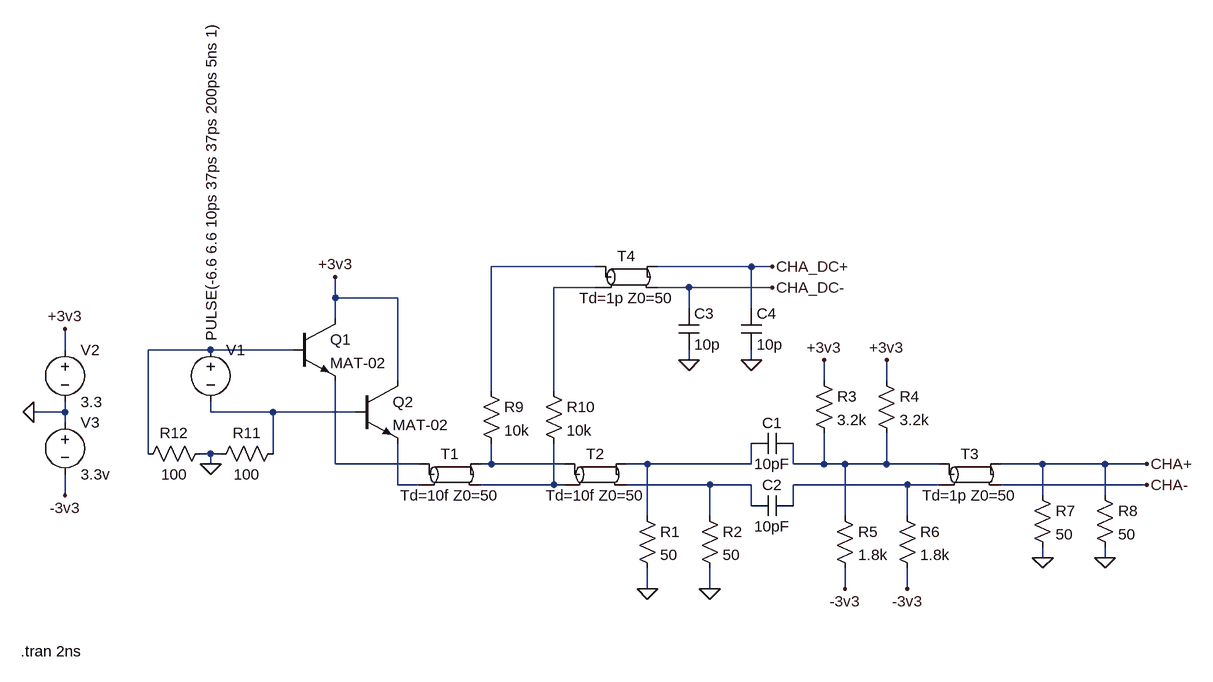
[diagram p0: schematic frontend_sig_DC_tap_reflections_sim.asc]
frontend_sig_DC_tap_reflections_sim.asc, the LTspice schematic file:
Version 4
SHEET 1 1012 680
WIRE 80 -176 -80 -176
WIRE 320 -176 176 -176
WIRE 352 -176 320 -176
WIRE 80 -144 16 -144
WIRE 224 -144 176 -144
WIRE 352 -144 224 -144
WIRE -320 -128 -320 -160
WIRE -224 -128 -320 -128
WIRE 224 -112 224 -144
WIRE 320 -112 320 -176
WIRE -320 -96 -320 -128
WIRE -736 -48 -736 -80
WIRE -512 -48 -608 -48
WIRE -384 -48 -512 -48
WIRE 224 -32 224 -48
WIRE 320 -32 320 -48
WIRE -224 0 -224 -128
WIRE 432 0 432 -32
WIRE 528 0 528 -32
WIRE -80 16 -80 -176
WIRE 16 16 16 -144
WIRE -736 48 -736 32
WIRE -736 48 -784 48
WIRE -512 48 -512 32
WIRE -416 48 -512 48
WIRE -288 48 -416 48
WIRE -736 64 -736 48
WIRE -608 112 -608 -48
WIRE -512 112 -528 112
WIRE -496 112 -512 112
WIRE -416 112 -416 48
WIRE -512 128 -512 112
WIRE -320 128 -320 0
WIRE -192 128 -320 128
WIRE -80 128 -80 96
WIRE -80 128 -96 128
WIRE 32 128 -80 128
WIRE 160 128 128 128
WIRE 320 128 320 96
WIRE 320 128 160 128
WIRE 384 128 384 96
WIRE 432 128 432 80
WIRE 432 128 384 128
WIRE 464 128 432 128
WIRE 528 128 528 80
WIRE 528 128 464 128
WIRE 608 128 528 128
WIRE 768 128 704 128
WIRE 864 128 768 128
WIRE 928 128 864 128
WIRE -224 160 -224 96
WIRE -192 160 -224 160
WIRE 16 160 16 96
WIRE 16 160 -96 160
WIRE 32 160 16 160
WIRE 256 160 128 160
WIRE 320 160 256 160
WIRE 560 160 384 160
WIRE 608 160 560 160
WIRE 928 160 704 160
WIRE -736 176 -736 144
WIRE 768 176 768 128
WIRE 864 176 864 128
WIRE 320 192 320 160
WIRE 384 192 384 160
WIRE 160 208 160 128
WIRE 256 208 256 160
WIRE 464 208 464 128
WIRE 560 208 560 160
WIRE 768 272 768 256
WIRE 864 272 864 256
WIRE 160 320 160 288
WIRE 256 320 256 288
WIRE 464 320 464 288
WIRE 560 320 560 288
FLAG -784 48 0
FLAG -736 -80 +3v3
FLAG 432 -32 +3v3
FLAG 528 -32 +3v3
FLAG 160 320 0
FLAG 256 320 0
FLAG 768 272 0
FLAG 864 272 0
FLAG 464 320 -3v3
FLAG 560 320 -3v3
FLAG -736 176 -3v3
FLAG 224 -32 0
FLAG 320 -32 0
FLAG -320 -160 +3v3
FLAG 928 128 CHA+
FLAG 928 160 CHA-
FLAG 352 -176 CHA_DC+
FLAG 352 -144 CHA_DC-
FLAG -512 128 0
SYMBOL tline -144 144 R0
SYMATTR InstName T1
SYMATTR Value Td=10f Z0=50
SYMBOL tline 80 144 R0
SYMATTR InstName T2
SYMATTR Value Td=10f Z0=50
SYMBOL cap 384 80 R90
WINDOW 0 0 32 VBottom 2
WINDOW 3 32 32 VTop 2
SYMATTR InstName C1
SYMATTR Value 10pF
SYMBOL cap 384 176 R90
WINDOW 0 0 32 VBottom 2
WINDOW 3 32 32 VTop 2
SYMATTR InstName C2
SYMATTR Value 10pF
SYMBOL res 144 192 R0
SYMATTR InstName R1
SYMATTR Value 50
SYMBOL res 240 192 R0
SYMATTR InstName R2
SYMATTR Value 50
SYMBOL res 416 -16 R0
SYMATTR InstName R3
SYMATTR Value 3.2k
SYMBOL res 512 -16 R0
SYMATTR InstName R4
SYMATTR Value 3.2k
SYMBOL res 448 192 R0
SYMATTR InstName R5
SYMATTR Value 1.8k
SYMBOL res 544 192 R0
SYMATTR InstName R6
SYMATTR Value 1.8k
SYMBOL tline 656 144 R0
SYMATTR InstName T3
SYMATTR Value Td=1p Z0=50
SYMBOL res 752 160 R0
SYMATTR InstName R7
SYMATTR Value 50
SYMBOL res 848 160 R0
SYMATTR InstName R8
SYMATTR Value 50
SYMBOL voltage -512 -64 R0
WINDOW 3 1 3 VLeft 2
WINDOW 123 0 0 Left 2
WINDOW 39 0 0 Left 2
SYMATTR InstName V1
SYMATTR Value PULSE(-6.6 6.6 10ps 37ps 37ps 200ps 5ns 1)
SYMBOL voltage -736 -64 R0
WINDOW 123 0 0 Left 2
WINDOW 39 0 0 Left 2
SYMATTR InstName V2
SYMATTR Value 3.3
SYMBOL voltage -736 48 R0
WINDOW 123 0 0 Left 2
WINDOW 39 0 0 Left 2
SYMATTR InstName V3
SYMATTR Value 3.3v
SYMBOL tline 128 -160 R0
SYMATTR InstName T4
SYMATTR Value Td=1p Z0=50
SYMBOL res -96 0 R0
SYMATTR InstName R9
SYMATTR Value 10k
SYMBOL res 0 0 R0
SYMATTR InstName R10
SYMATTR Value 10k
SYMBOL cap 208 -112 R0
SYMATTR InstName C3
SYMATTR Value 10p
SYMBOL cap 304 -112 R0
SYMATTR InstName C4
SYMATTR Value 10p
SYMBOL npn -384 -96 R0
SYMATTR InstName Q1
SYMATTR Value MAT-02
SYMBOL npn -288 0 R0
SYMATTR InstName Q2
SYMATTR Value MAT-02
SYMBOL res -400 96 R90
WINDOW 0 0 56 VBottom 2
WINDOW 3 32 56 VTop 2
SYMATTR InstName R11
SYMATTR Value 100
SYMBOL res -512 96 R90
WINDOW 0 0 56 VBottom 2
WINDOW 3 32 56 VTop 2
SYMATTR InstName R12
SYMATTR Value 100
TEXT -804 416 Left 2 !.tran 2ns

The netlist it stands for:
* frontend_sig_DC_tap_reflections_sim.asc
T1 N005 N009 N006 N010 Td=10f Z0=50
T2 N006 N010 N007 N011 Td=10f Z0=50
C1 N008 N007 10pF
C2 N012 N011 10pF
R1 N007 0 50
R2 N011 0 50
R3 +3v3 N008 3.2k
R4 +3v3 N008 3.2k
R5 N008 -3v3 1.8k
R6 N012 -3v3 1.8k
T3 N008 N012 CHA+ CHA- Td=1p Z0=50
R7 CHA+ 0 50
R8 CHA+ 0 50
V1 N003 N004 PULSE(-6.6 6.6 10ps 37ps 37ps 200ps 5ns 1)
V2 +3v3 0 3.3
V3 0 -3v3 3.3v
T4 N001 N002 CHA_DC+ CHA_DC- Td=1p Z0=50
R9 N001 N006 10k
R10 N002 N010 10k
C3 CHA_DC- 0 10p
C4 CHA_DC+ 0 10p
Q1 +3v3 N003 N005 0 MAT-02
Q2 +3v3 N004 N009 0 MAT-02
R11 N004 0 100
R12 0 N003 100
.model NPN NPN
.model PNP PNP
.lib standard.bjt
.tran 2ns
.backanno
.end